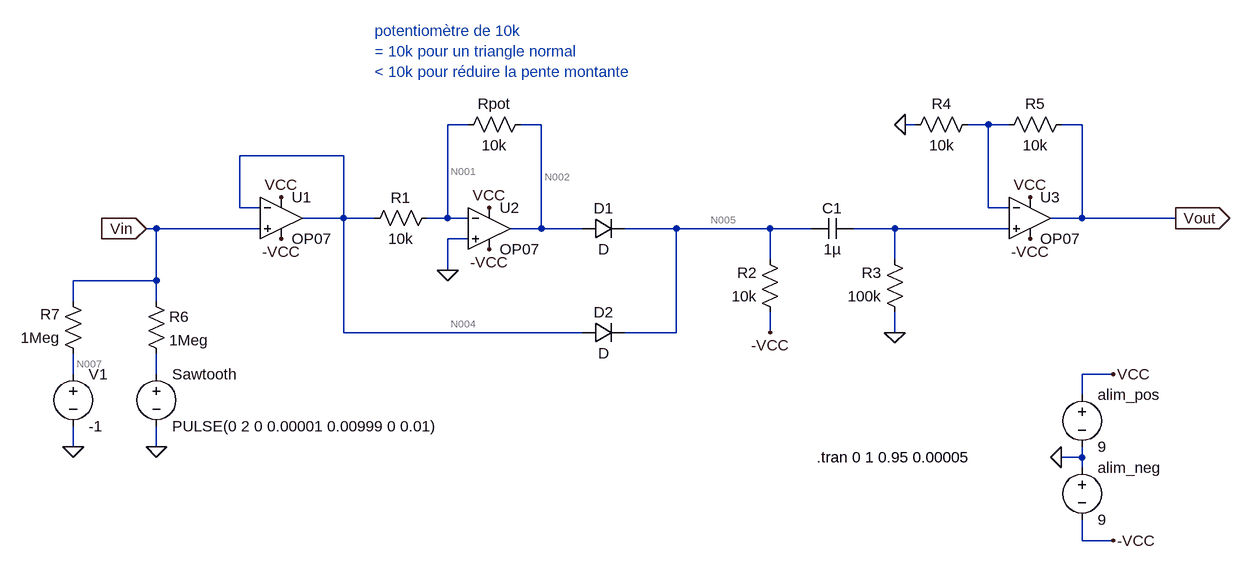
[diagram p0: schematic saw_to_triangle.asc]
saw_to_triangle.asc, the LTspice schematic file:
Version 4.1
SHEET 1 1888 680
WIRE 544 -48 512 -48
WIRE 656 -48 624 -48
WIRE 1232 -48 1216 -48
WIRE 1344 -48 1312 -48
WIRE 1376 -48 1344 -48
WIRE 1488 -48 1456 -48
WIRE 352 0 192 0
WIRE 192 80 192 0
WIRE 224 80 192 80
WIRE 1344 80 1344 -48
WIRE 1376 80 1344 80
WIRE 352 96 352 0
WIRE 352 96 288 96
WIRE 400 96 352 96
WIRE 512 96 512 -48
WIRE 512 96 480 96
WIRE 544 96 512 96
WIRE 1488 96 1488 -48
WIRE 1488 96 1440 96
WIRE 1632 96 1488 96
WIRE 64 112 48 112
WIRE 224 112 64 112
WIRE 656 112 656 -48
WIRE 656 112 608 112
WIRE 720 112 656 112
WIRE 864 112 784 112
WIRE 1008 112 864 112
WIRE 1072 112 1008 112
WIRE 1200 112 1136 112
WIRE 1376 112 1200 112
WIRE 544 128 512 128
WIRE 1008 160 1008 112
WIRE 1200 160 1200 112
WIRE 512 176 512 128
WIRE 64 192 64 112
WIRE 64 192 -64 192
WIRE -64 224 -64 192
WIRE 64 224 64 192
WIRE 352 272 352 96
WIRE 720 272 352 272
WIRE 864 272 864 112
WIRE 864 272 784 272
WIRE 1008 272 1008 240
WIRE 1200 272 1200 240
WIRE -64 336 -64 304
WIRE 64 336 64 304
WIRE 1536 336 1488 336
WIRE 1488 368 1488 336
WIRE -64 448 -64 416
WIRE 64 448 64 416
WIRE 1488 464 1488 448
WIRE 1488 464 1456 464
WIRE 1488 480 1488 464
WIRE 1488 592 1488 560
WIRE 1536 592 1488 592
FLAG 48 112 Vin
IOPIN 48 112 In
FLAG 1456 464 0
FLAG 1632 96 Vout
IOPIN 1632 96 Out
FLAG 1536 336 VCC
FLAG 1536 592 -VCC
FLAG 256 64 VCC
FLAG 512 176 0
FLAG 1408 64 VCC
FLAG 576 80 VCC
FLAG 1200 272 0
FLAG 1216 -48 0
FLAG 1408 128 -VCC
FLAG 1008 272 -VCC
FLAG 576 144 -VCC
FLAG 64 448 0
FLAG -64 448 0
FLAG 256 128 -VCC
SYMBOL res 496 80 R90
WINDOW 0 0 56 VBottom 2
WINDOW 3 32 56 VTop 2
SYMATTR InstName R1
SYMATTR Value 10k
SYMBOL res 1024 256 R180
WINDOW 0 36 76 Left 2
WINDOW 3 36 40 Left 2
SYMATTR InstName R2
SYMATTR Value 10k
SYMBOL res 1216 256 R180
WINDOW 0 36 76 Left 2
WINDOW 3 36 40 Left 2
SYMATTR InstName R3
SYMATTR Value 100k
SYMBOL res 1328 -64 R90
WINDOW 0 0 56 VBottom 2
WINDOW 3 32 56 VTop 2
SYMATTR InstName R4
SYMATTR Value 10k
SYMBOL res 1472 -64 R90
WINDOW 0 0 56 VBottom 2
WINDOW 3 32 56 VTop 2
SYMATTR InstName R5
SYMATTR Value 10k
SYMBOL res 640 -64 R90
WINDOW 0 0 56 VBottom 2
WINDOW 3 32 56 VTop 2
SYMATTR InstName Rpot
SYMATTR Value 10k
SYMBOL OpAmps\\OP07 256 32 R0
SYMATTR InstName U1
SYMBOL voltage 1488 352 R0
SYMATTR InstName alim_pos
SYMATTR Value 9
SYMBOL voltage 1488 464 R0
SYMATTR InstName alim_neg
SYMATTR Value 9
SYMBOL diode 720 128 R270
WINDOW 0 32 32 VTop 2
WINDOW 3 0 32 VBottom 2
SYMATTR InstName D1
SYMBOL diode 720 288 R270
WINDOW 0 32 32 VTop 2
WINDOW 3 0 32 VBottom 2
SYMATTR InstName D2
SYMBOL OpAmps\\OP07 1408 32 R0
SYMATTR InstName U3
SYMBOL OpAmps\\OP07 576 48 R0
SYMATTR InstName U2
SYMBOL cap 1072 128 R270
WINDOW 0 32 32 VTop 2
WINDOW 3 0 32 VBottom 2
SYMATTR InstName C1
SYMATTR Value 1µ
SYMBOL voltage 64 320 R0
WINDOW 123 0 0 Left 0
WINDOW 39 0 0 Left 0
SYMATTR InstName Sawtooth
SYMATTR Value PULSE(0 2 0 0.00001 0.00999 0 0.01)
SYMBOL res 48 208 R0
SYMATTR InstName R6
SYMATTR Value 1Meg
SYMBOL res -48 320 R180
WINDOW 0 36 76 Left 2
WINDOW 3 36 40 Left 2
SYMATTR InstName R7
SYMATTR Value 1Meg
SYMBOL voltage -64 320 R0
SYMATTR InstName V1
SYMATTR Value -1
TEXT 1080 464 Left 2 !.tran 0 1 0.95 0.00005
TEXT 400 -192 Left 2 ;potentiomètre de 10k\n= 10k pour un triangle normal\n< 10k pour réduire la pente montante

The netlist it stands for:
* saw_to_triangle.asc
R1 N001 N004 10k
R2 -VCC N005 10k
R3 0 N006 100k
R4 N003 0 10k
R5 Vout N003 10k
Rpot N002 N001 10k
X§U1 Vin N004 VCC -VCC N004 LT1001  ; OP07, pins In+ In- V+ V- OUT
V§alim_pos VCC 0 9
V§alim_neg 0 -VCC 9
D1 N002 N005 D
D2 N004 N005 D
X§U3 N006 N003 VCC -VCC Vout LT1001  ; OP07, pins In+ In- V+ V- OUT
X§U2 0 N001 VCC -VCC N002 LT1001  ; OP07, pins In+ In- V+ V- OUT
C1 N005 N006 1µ
V§Sawtooth N008 0 PULSE(0 2 0 0.00001 0.00999 0 0.01)
R6 Vin N008 1Meg
R7 N007 Vin 1Meg
V1 N007 0 -1
.model D D
.lib standard.dio
.tran 0 1 0.95 0.00005
* potentiomètre de 10k
* = 10k pour un triangle normal
* < 10k pour réduire la pente montante
.lib LTC.lib
.backanno
.end

* Results of the author's LTspice run, read from the files saved beside the schematic
* Operating Point, zero values left out:
*   V(n004) = -500 mV
*   V(n005) = -152 mV
*   V(vcc) = 9 V
*   V(n007) = -1 V
*   V(n001) = -711.9 nV
*   V(-vcc) = -9 V
*   V(n002) = 500 mV
*   V(vin) = -500 mV
*   I(alim_pos) = -7.217 mA
*   I(R6) = -500 nA
*   I(R7) = -500 nA
*   I(R1) = 50 µA
*   I(Rpot) = 50 µA
*   I(D1) = 884.8 µA
*   I(R2) = -884.8 µA
*   I(alim_neg) = -7.217 mA
*   I(Sawtooth) = -500 nA
*   I(V1) = 500 nA
*   Ix(u3:3) = 2.25 mA
*   Ix(u3:4) = -2.25 mA
*   Ix(u1:3) = 2.225 mA
*   Ix(u1:4) = -2.275 mA
*   Ix(u1:5) = 50 µA
*   Ix(u2:3) = 2.742 mA
*   Ix(u2:4) = -1.807 mA
*   Ix(u2:5) = -934.8 µA
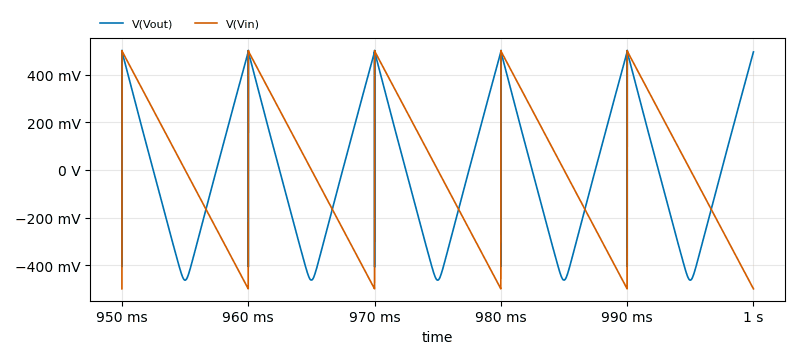
[diagram p1: Transient Analysis of saw_to_triangle.asc, plotted from the saved traces]
* Transient Analysis, 1 run:
*   V(Vout): min -463.6 mV, max 503.4 mV, average 75.61 µV, rms 299 mV, last 496.9 mV
*   V(Vin): min -499.9 mV, max 502.3 mV, average 0 V, rms 292 mV, last -499.9 mV